# Altium schematic sheet Sheet1.SchDoc
size A; SheetNumber: 2; SheetTotal: 1
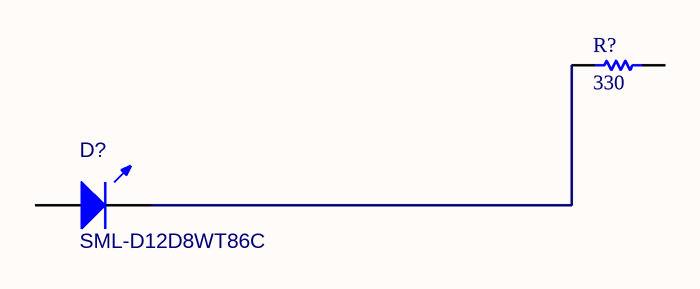
[diagram p0: Sheet1.SchDoc]

## Parts
D?  SML-D12D8WT86C  [LED 0603]
R?  value 330  [0603 RES]  (hidden comment: resistor_330_005_0603)

## Nets
NetD?_2: D?.2 R?.1

Not connected (* = marked no-connect by the designer): D? 1; R? 2

## Library data of the parts
D? = CMP-007-00004-1: Single Color LED; Forward Voltage Drop: 2.2V; Colour: Orange; Forward Current: 20mA; Case/Package: 0603
R? = CMP-009-00006-3: Fixed Resistor, Metal Glaze/thick Film, 0.2W, 330ohm, 50V, 5% +/-Tol, 100ppm/Cel, Surface Mount, 0603; Voltage Value: 50; Tolerance: 5%; Case/Package: 0603